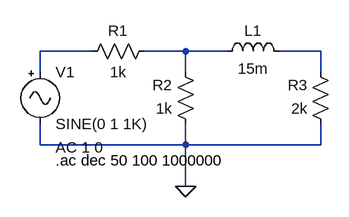
[diagram p0: schematic P2.asc]
P2.asc, the LTspice schematic file:
Version 4.1
SHEET 1 880 680
WIRE 64 128 -16 128
WIRE 208 128 144 128
WIRE 272 128 208 128
WIRE 416 128 352 128
WIRE -16 160 -16 128
WIRE 208 160 208 128
WIRE 416 160 416 128
WIRE -16 272 -16 240
WIRE 208 272 208 240
WIRE 208 272 -16 272
WIRE 416 272 416 240
WIRE 416 272 208 272
WIRE 208 336 208 272
FLAG 208 336 0
SYMBOL res 160 112 R90
WINDOW 0 0 56 VBottom 2
WINDOW 3 32 56 VTop 2
SYMATTR InstName R1
SYMATTR Value 1k
SYMBOL res 224 256 R180
WINDOW 0 36 76 Left 2
WINDOW 3 36 40 Left 2
SYMATTR InstName R2
SYMATTR Value 1k
SYMBOL res 432 256 R180
WINDOW 0 36 76 Left 2
WINDOW 3 36 40 Left 2
SYMATTR InstName R3
SYMATTR Value 2k
SYMBOL ind 256 144 R270
WINDOW 0 32 56 VTop 2
WINDOW 3 5 56 VBottom 2
SYMATTR InstName L1
SYMATTR Value 15m
SYMATTR SpiceLine Rser=1m
SYMBOL Misc\\signal -16 144 R0
WINDOW 123 24 132 Left 2
WINDOW 39 0 0 Left 0
SYMATTR InstName V1
SYMATTR Value2 AC 1 0
TEXT 8 296 Left 2 !.ac dec 50 100 1000000

The netlist it stands for:
* P2.asc
R1 N002 N001 1k
R2 0 N002 1k
R3 0 N003 2k
L1 N002 N003 15m Rser=1m
V1 N001 0 SINE(0 1 1K) AC 1 0
.ac dec 50 100 1000000
.backanno
.end